# EAGLE design TiNRS - RoundedCornerThing (EAGLE 7.7.0)

## Sheet 1 of 4: Power & Modulation Routing
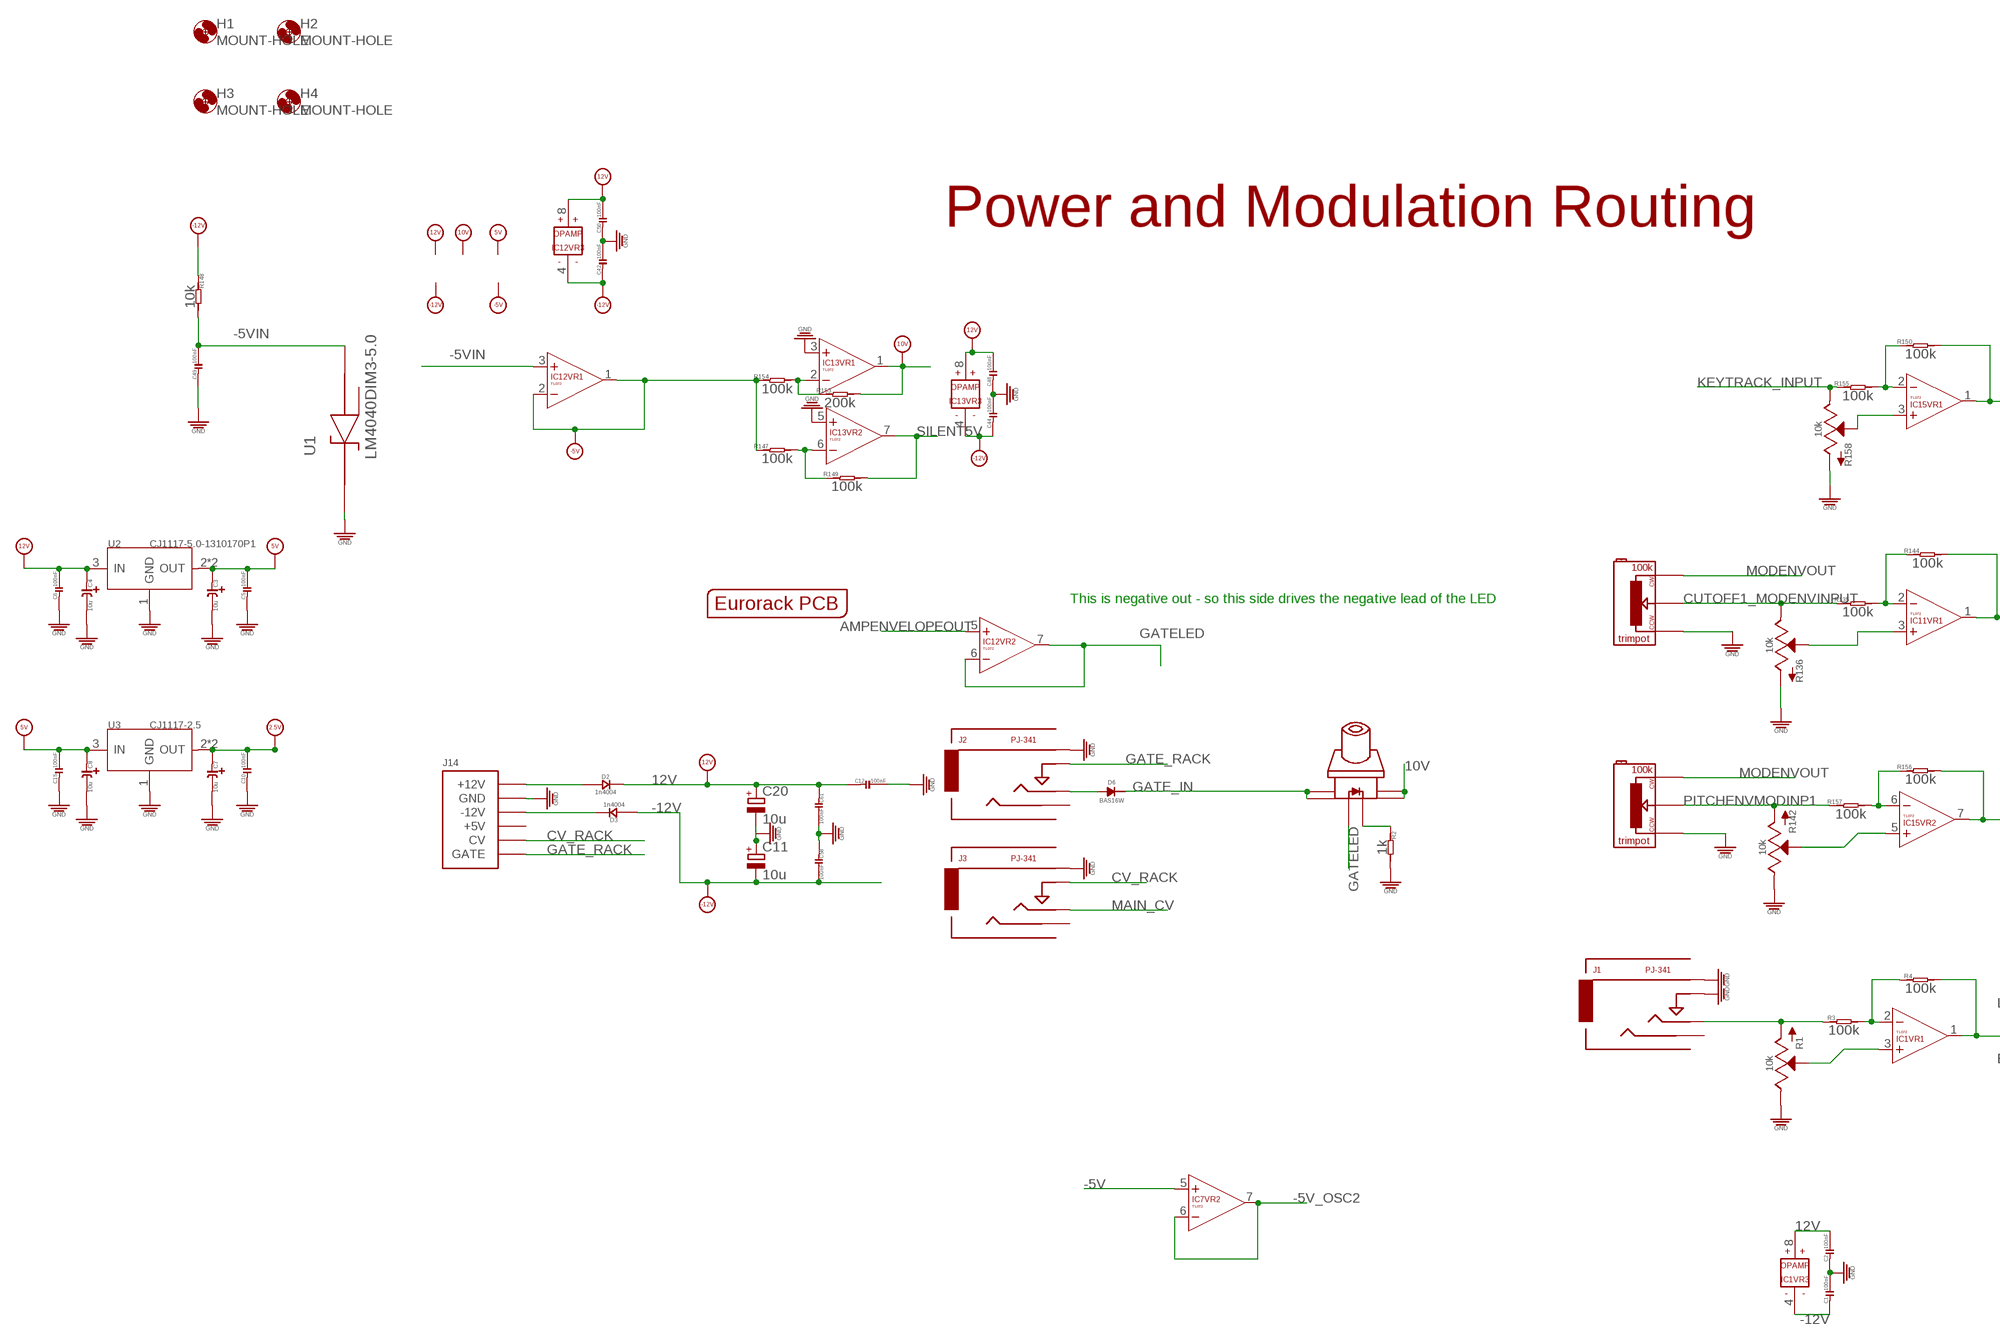
[diagram p0: schematic, sheet 1, part 1 of 2]
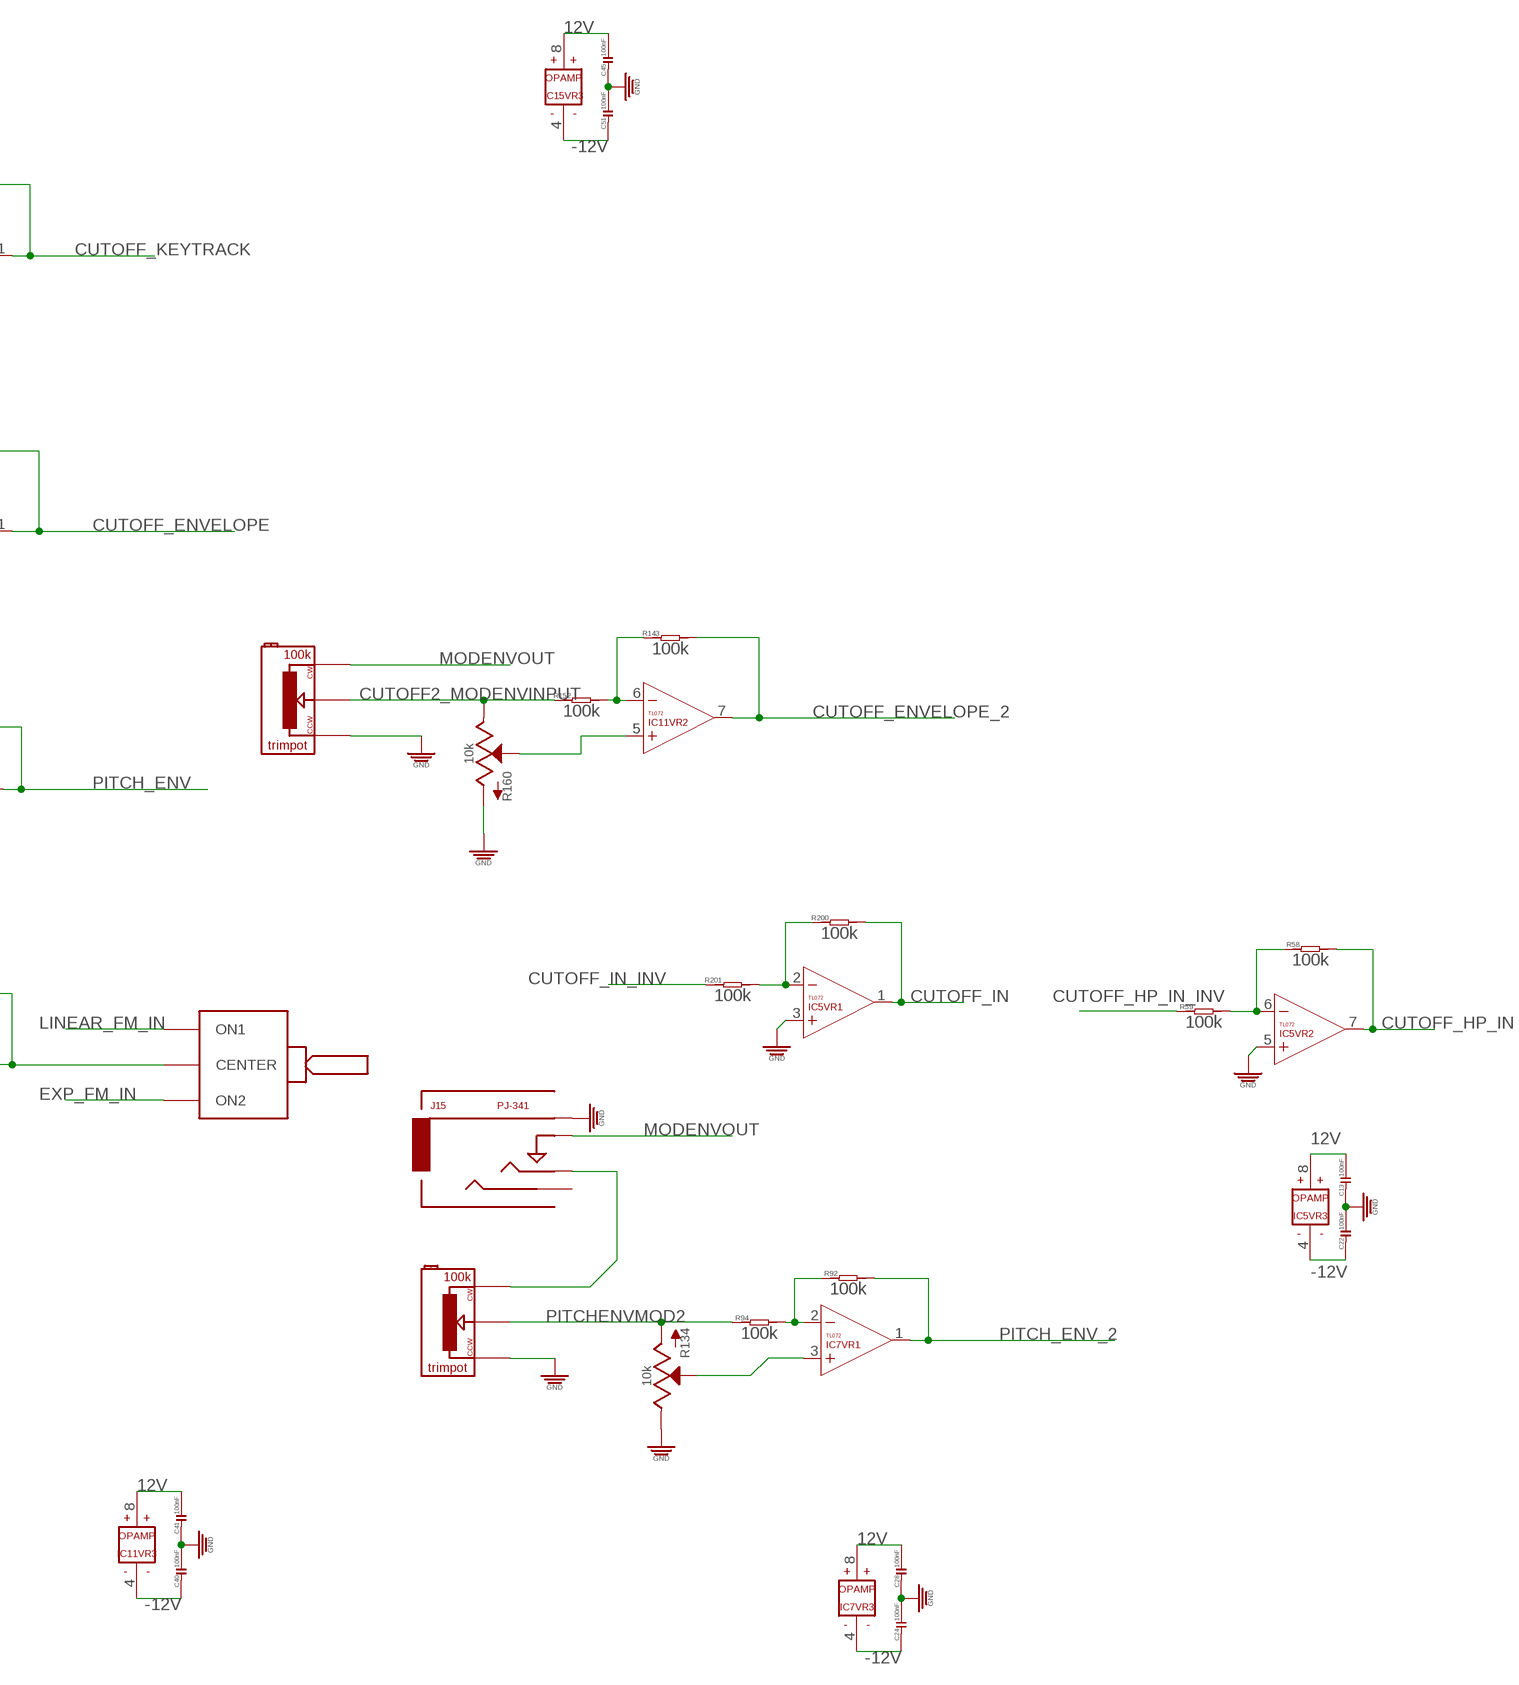
[diagram p1: schematic, sheet 1, part 2 of 2]

### Parts
C1  100nF  C-0603  [C0603]
C2  100nF  C-0603  [C0603]
C3  10u  C-POLAR-A  [CASE-A_3216]
C4  10u  C-POLAR-A  [CASE-A_3216]
C5  100nF  C-0603  [C0603]
C6  100nF  C-0603  [C0603]
C7  10u  C-POLAR-A  [CASE-A_3216]
C8  10u  C-POLAR-A  [CASE-A_3216]
C10  100nF  C-0603  [C0603]
C11  10u  CAPACITOR_POL-CASE_B  [CASE_B]
C12  100nF  C-0603  [C0603]
C13  100nF  C-0603  [C0603]
C15  100nF  C-0603  [C0603]
C20  10u  CAPACITOR_POL-CASE_B  [CASE_B]
C22  100nF  C-0603  [C0603]
C24  100nF  C-0603  [C0603]
C28  100nF  C-0603  [C0603]
C40  100nF  C-0603  [C0603]
C41  100nF  C-0603  [C0603]
C42  100nF  C-0603  [C0603]
C44  100nF  C-0603  [C0603]
C45  100nF  C-0603  [C0603]
C48  100nF  C-0603  [C0603]
C49  100nF  C-0603  [C0603]
C50  100nF  C-0603  [C0603]
C51  100nF  C-0603  [C0603]
C58  100nF  C-0603  [C0603]
C61  100nF  C-0603  [C0603]
D2  1n4004  D-SMA  [DO-214AC]
D3  1n4004  D-SMA  [DO-214AC]
D6  BAS16W  [SOT-323]
H1  MOUNT-HOLE  [3.2-NOMARKINGS-SMALLSAFEZONE]
H2  MOUNT-HOLE  [3.2-NOMARKINGS-SMALLSAFEZONE]
H3  MOUNT-HOLE  [3.2-NOMARKINGS-SMALLSAFEZONE]
H4  MOUNT-HOLE  [3.2-NOMARKINGS-SMALLSAFEZONE]
IC1  TL072  [SO08]
IC5  TL072  [SO08]
IC7  TL072  [SO08]
IC11  TL072  [SO08]
IC12  TL072  [SO08]
IC13  TL072  [SO08]
IC15  TL072  [SO08]
J1  PJ-341  AUDIO-JACKNODRILL  [3.5MM-JACK-SWITCH-13MM-NOHOLES]
J2  PJ-341  AUDIO-JACKNODRILL  [3.5MM-JACK-SWITCH-13MM-NOHOLES]
J3  PJ-341  AUDIO-JACKNODRILL  [3.5MM-JACK-SWITCH-13MM-NOHOLES]
J14  POWERSHROUDED  [POWER_16_SHROUDED]
J15  PJ-341  AUDIO-JACKNODRILL  [3.5MM-JACK-SWITCH-13MM-NOHOLES]
PCB1  EURORACK_PCB36HP_10CM  [EURORACK36HP]
R1  10k  POTSQUAREHOLE_SMALLKNOB  [ALPS_POT_SQUAREHOLES]
R2  1k  R-0603  [R0603]
R3  100k  R-0603  [R0603]
R4  100k  R-0603  [R0603]
R58  100k  R-0603  [R0603]
R59  100k  R-0603  [R0603]
R92  100k  R-0603  [R0603]
R94  100k  R-0603  [R0603]
R134  10k  POTSQUAREHOLE_SMALLKNOB  [ALPS_POT_SQUAREHOLES]
R135  100k  R-0603  [R0603]
R136  10k  POTSQUAREHOLE_SMALLKNOB  [ALPS_POT_SQUAREHOLES]
R142  10k  POTSQUAREHOLE_SMALLKNOB  [ALPS_POT_SQUAREHOLES]
R143  100k  R-0603  [R0603]
R144  100k  R-0603  [R0603]
R147  100k  R-0603  [R0603]
R148  10k  R-0603  [R0603]
R149  100k  R-0603  [R0603]
R150  100k  R-0603  [R0603]
R152  100k  R-0603  [R0603]
R153  200k  R-0603  [R0603]
R154  100k  R-0603  [R0603]
R155  100k  R-0603  [R0603]
R156  100k  R-0603  [R0603]
R157  100k  R-0603  [R0603]
R158  10k  POTSQUAREHOLE_SMALLKNOB  [ALPS_POT_SQUAREHOLES]
R160  10k  POTSQUAREHOLE_SMALLKNOB  [ALPS_POT_SQUAREHOLES]
R191  100k  TRIMPOT  [TRIMPOT]
R192  100k  TRIMPOT  [TRIMPOT]
R193  100k  TRIMPOT  [TRIMPOT]
R194  100k  TRIMPOT  [TRIMPOT]
R200  100k  R-0603  [R0603]
R201  100k  R-0603  [R0603]
S1  ONOFFONNOHOLES  [MULTICOMP1MS-ONOFFON_NOHOLES]
S2  SWITCH_W_LED_PB6149L-X-102YELLOW  [PB6149L]
U1  LM4040DIM3-5.0  [SOT95P237X112-3N]
U2  CJ1117-5.0-1310170P1  [SOT223]
U3  CJ1117-2.5  CJ1117-5.0-1310170P1  [SOT223]

### Nets
2.5V [power]: C7.+ C10.2 U3.2(OUT) U3.TER(OUT) ; also sheet 2
5V [power]: C3.+ C5.2 C8.+ C15.2 U2.2(OUT) U2.TER(OUT) U3.3(IN) ; also sheet 2,3,4
10V [power]: IC13.1(VR1:OUT) R153.2 S2.3 S2.4 ; also sheet 4
12V [power]: C2.2 C4.+ C6.2 C12.1 C13.2 C20.+ C28.2 C41.2 C45.2 C48.2 C50.2 C61.1 D2.2(-) IC1.8(VR3:V+) IC5.8(VR3:V+) IC7.8(VR3:V+) IC11.8(VR3:V+) IC12.8(VR3:V+) IC13.8(VR3:V+) IC15.8(VR3:V+) U2.3(IN) ; also sheet 2,3
-5_TO_10V: IC13.2(VR1:-IN) R153.1 R154.2
-5V [power]: IC7.5(VR2:+IN) IC12.1(VR1:OUT) IC12.2(VR1:-IN) R147.1 R154.1 ; also sheet 2,3
-5V_OSC2: IC7.6(VR2:-IN) IC7.7(VR2:OUT)
-5V_TO_5V: IC13.6(VR2:-IN) R147.2 R149.1
-5VIN [power]: C49.2 IC12.3(VR1:+IN) R148.2 U1.2(ANODE)
-12V [power]: C1.1 C11.- C22.1 C24.1 C40.1 C42.1 C44.1 C51.1 C58.2 D3.1(+) IC1.4(VR3:V-) IC5.4(VR3:V-) IC7.4(VR3:V-) IC11.4(VR3:V-) IC12.4(VR3:V-) IC13.4(VR3:V-) IC15.4(VR3:V-) R148.1 ; also sheet 2,3
AMPENVELOPEOUT: IC12.5(VR2:+IN) ; also sheet 3
CUTOFF1_MODENVINPUT: R135.1 R136.P$1(E) R192.P$2
CUTOFF2_MODENVINPUT: R152.1 R160.P$1(E) R194.P$2
CUTOFF_ENVELOPE: IC11.1(VR1:OUT) R144.2
CUTOFF_ENVELOPE_2: IC11.7(VR2:OUT) R143.2
CUTOFF_HP_IN: IC5.7(VR2:OUT) R58.2
CUTOFF_HP_IN_INV: R59.1 ; also sheet 4
CUTOFF_IN: IC5.1(VR1:OUT) R200.2
CUTOFF_IN_INV: R201.1 ; also sheet 4
CUTOFF_KEYTRACK: IC15.1(VR1:OUT) R150.2
CV_RACK: J3.SWITCH_B@1(SWITCH) J3.SWITCH_T@3(SWITCH) J14.13(CV) J14.14(CV)
EXP_FM_IN: S1.3_B(ON2) S1.3_T(ON2) ; also sheet 2
GATE_IN: D6.CATHODE S2.1 S2.2 ; also sheet 3
GATE_RACK: J2.SWITCH_B@1(SWITCH) J2.SWITCH_T@3(SWITCH) J14.15(GATE) J14.16(GATE)
GATELED: IC12.6(VR2:-IN) IC12.7(VR2:OUT) S2.LEDPOS(POS)
GND [power]: C1.2 C2.1 C3.- C4.- C5.1 C6.1 C7.- C8.- C10.1 C11.+ C12.2 C13.1 C15.1 C20.- C22.2 C24.2 C28.1 C40.2 C41.1 C42.2 C44.2 C45.1 C48.1 C49.1 C50.1 C51.2 C58.1 C61.2 IC5.3(VR1:+IN) IC5.5(VR2:+IN) IC13.3(VR1:+IN) IC13.5(VR2:+IN) J1.RING_B@1(RING) J1.RING_T@3(RING) J1.SWITCH_B@1(SWITCH) J1.SWITCH_T@3(SWITCH) J2.RING_B@1(RING) J2.RING_T@3(RING) J3.RING_B@1(RING) J3.RING_T@3(RING) J14.3(GND) J14.4(GND) J14.5(GND) J14.6(GND) J14.7(GND) J14.8(GND) J15.RING_B@1(RING) J15.RING_T@3(RING) R1.P$1(E) R2.2 R134.P$1(E) R136.P$3(A) R142.P$1(E) R158.P$3(A) R160.P$3(A) R191.P$1 R192.P$1 R193.P$1 R194.P$1 U1.1(CATHODE) U2.1(GND) U3.1(GND) ; also sheet 2,3,4
KEYTRACK_INPUT: R155.1 R158.P$1(E) ; also sheet 2
LINEAR_FM_IN: S1.1_B(ON1) S1.1_T(ON1)
MAIN_CV: J3.TIP_B@1(TIP) J3.TIP_T@3(TIP) ; also sheet 2
MODENVOUT: J15.SWITCH_B@1(SWITCH) J15.SWITCH_T@3(SWITCH) R192.P$3 R193.P$3 R194.P$3 ; also sheet 3
N$7 [power]: D2.1(+) J14.9(+12V) J14.10(+12V)
N$8 [power]: D3.2(-) J14.1(-12V) J14.2(-12V)
N$22: R2.1 S2.LEDNEG(NEG)
N$39: J15.TIP_B@1(TIP) J15.TIP_T@3(TIP) R191.P$3
N$41: IC1.1(VR1:OUT) R4.2 S1.2_B(CENTER) S1.2_T(CENTER)
N$56: IC5.6(VR2:-IN) R58.1 R59.2
N$66: IC1.2(VR1:-IN) R3.2 R4.1
N$67: IC15.2(VR1:-IN) R150.1 R155.2
N$68: IC15.3(VR1:+IN) R158.P$2(S)
N$69: IC11.2(VR1:-IN) R135.2 R144.1
N$72: IC15.6(VR2:-IN) R156.1 R157.2
N$73: IC11.3(VR1:+IN) R136.P$2(S)
N$75: IC7.2(VR1:-IN) R92.1 R94.2
N$76: IC7.3(VR1:+IN) R134.P$2(S)
N$78: IC15.5(VR2:+IN) R142.P$2(S)
N$81: IC1.3(VR1:+IN) R1.P$2(S)
N$82: J1.TIP_B@1(TIP) J1.TIP_T@3(TIP) R1.P$3(A) R3.1
N$86: D6.ANODE J2.TIP_B@1(TIP) J2.TIP_T@3(TIP)
N$126: IC11.6(VR2:-IN) R143.1 R152.2
N$127: IC11.5(VR2:+IN) R160.P$2(S)
N$148: IC5.2(VR1:-IN) R200.1 R201.2
PITCH_ENV: IC15.7(VR2:OUT) R156.2
PITCH_ENV_2: IC7.1(VR1:OUT) R92.2
PITCHENVMOD2: R94.1 R134.P$3(A) R191.P$2
PITCHENVMODINP1: R142.P$3(A) R157.1 R193.P$2
SILENT5V [power]: IC13.7(VR2:OUT) R149.2
Unconnected: IC1.5(VR2:+IN) IC1.6(VR2:-IN) IC1.7(VR2:OUT) J1.SECOND_B@1(SECOND) J1.SECOND_T@3(SECOND) J2.SECOND_B@1(SECOND) J2.SECOND_T@3(SECOND) J3.SECOND_B@1(SECOND) J3.SECOND_T@3(SECOND) J14.11(+5V) J14.12(+5V) J15.SECOND_B@1(SECOND) J15.SECOND_T@3(SECOND) U1.3(NC)

### Notes on the sheet
- Power and Modulation Routing
- This is negative out - so this side drives the negative lead of the LED

## Sheet 2 of 4: Oscillator
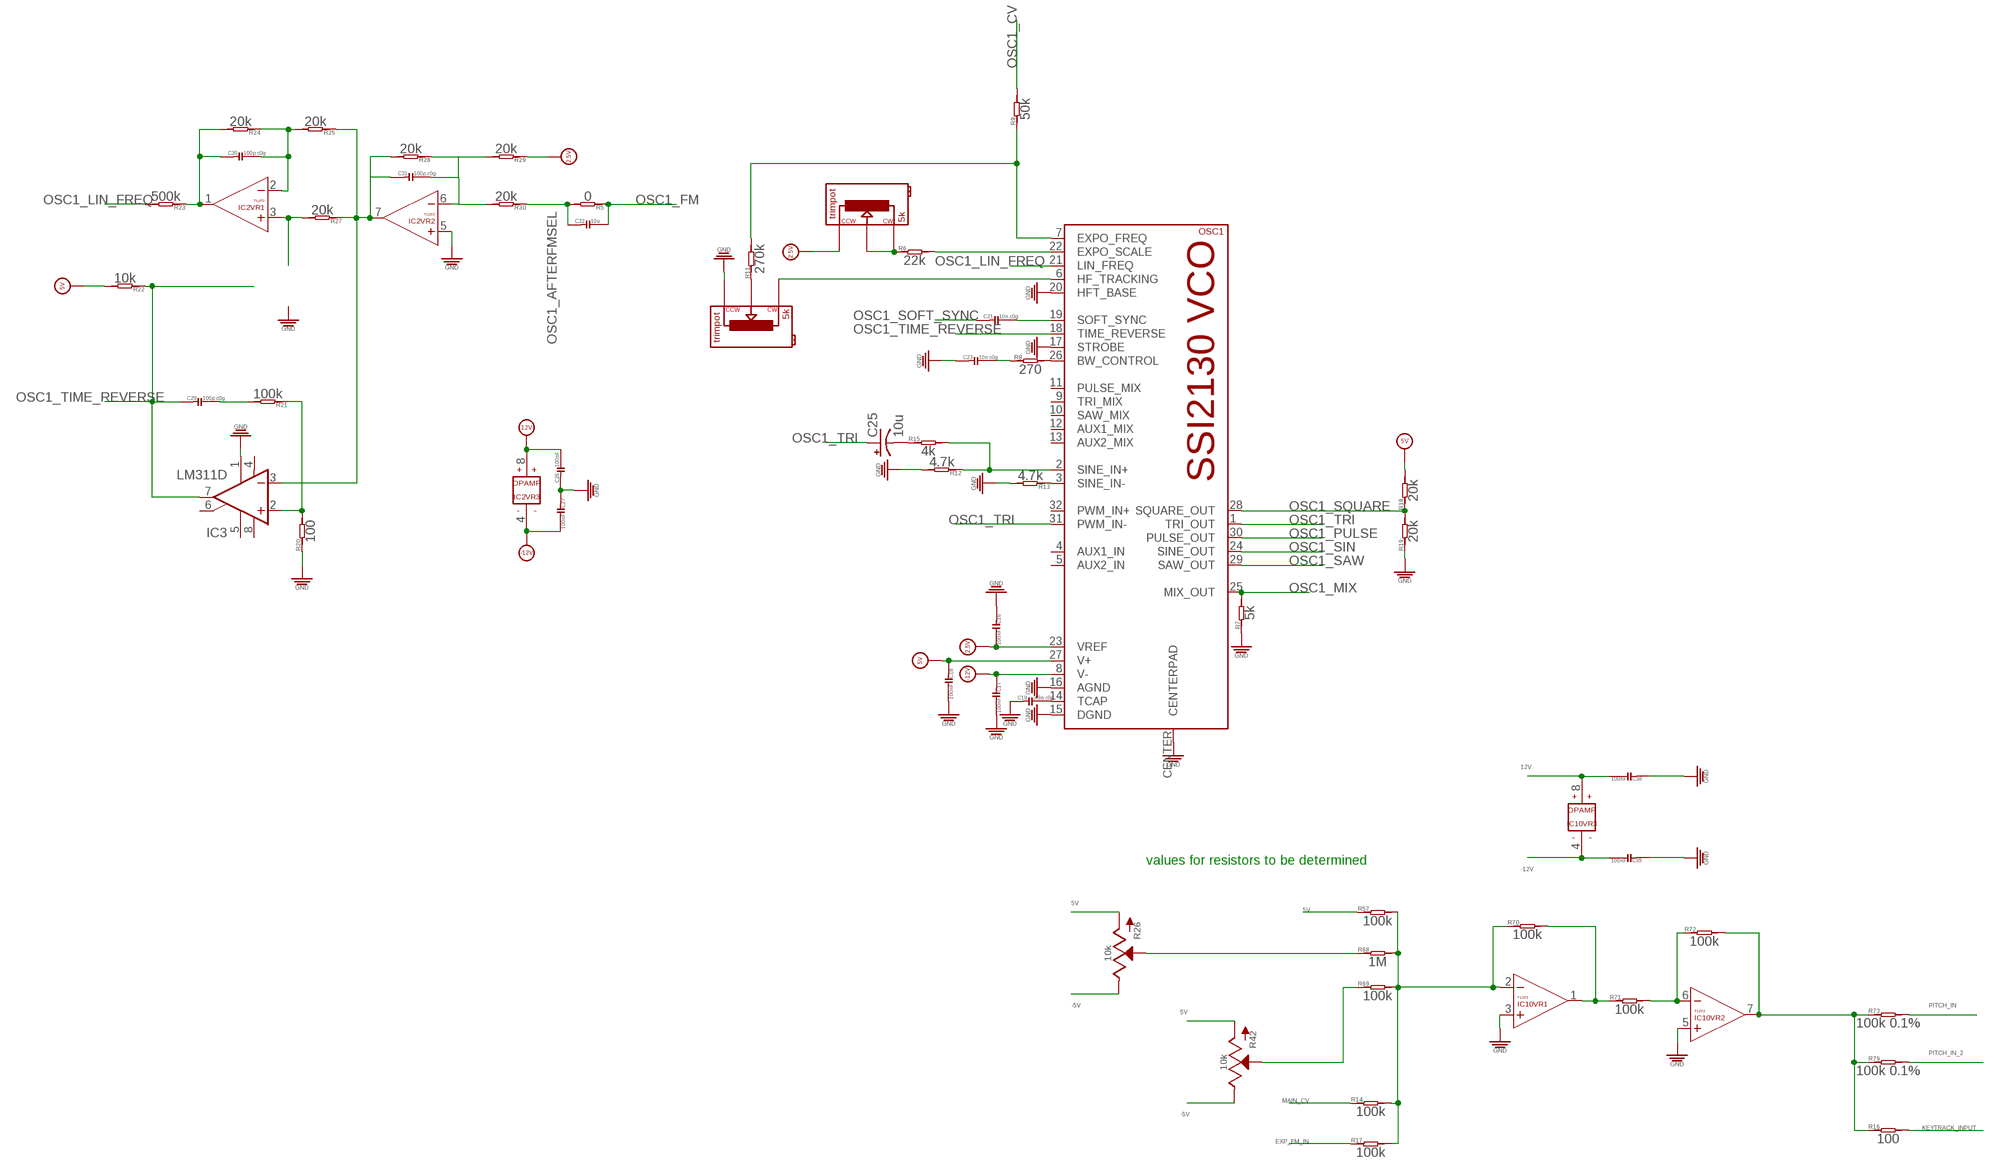
[diagram p2: schematic, sheet 2]

### Parts
C16  100nF  C-0603  [C0603]
C17  100nF  C-0603  [C0603]
C18  100nF  C-0603  [C0603]
C19  3.9n c0g  C-0603  [C0603]
C21  10n c0g  C-0603  [C0603]
C23  10n c0g  C-0603  [C0603]
C25  10u  CPOL-US153CLV-0605  [153CLV-0605]
C26  100nF  C-0603  [C0603]
C27  100nF  C-0603  [C0603]
C29  100p c0g  C-0603  [C0603]
C30  100p c0g  C-0603  [C0603]
C31  100p c0g  C-0603  [C0603]
C32  10u  C-0603  [C0603]
C38  100nF  C-0603  [C0603]
C39  100nF  C-0603  [C0603]
IC2  TL072  [SO08]
IC3  LM311D  [SO08]
IC10  TL072  [SO08]
OSC1  SSI2130  [QFN32_4X4]
R5  0  R-0603  [R0603]
R6  22k  R-0603  [R0603]
R7  5k  R-0603  [R0603]
R8  270  R-0603  [R0603]
R9  50k  R-0603  [R0603]
R10  5k  TRIMPOT  [TRIMPOT]
R11  270k  R-0603  [R0603]
R12  4.7k  R-0603  [R0603]
R13  4.7k  R-0603  [R0603]
R14  100k  R-0603  [R0603]
R15  4k  R-0603  [R0603]
R16  100  R-0603  [R0603]
R17  100k  R-0603  [R0603]
R18  20k  R-0603  [R0603]
R19  20k  R-0603  [R0603]
R20  100  R-0603  [R0603]
R21  100k  R-0603  [R0603]
R22  10k  R-0603  [R0603]
R23  500k  R-0603  [R0603]
R24  20k  R-0603  [R0603]
R25  20k  R-0603  [R0603]
R26  10k  POTSQUAREHOLE_SMALLKNOB  [ALPS_POT_SQUAREHOLES]
R27  20k  R-0603  [R0603]
R28  20k  R-0603  [R0603]
R29  20k  R-0603  [R0603]
R30  20k  R-0603  [R0603]
R42  10k  POTSQUAREHOLE_SMALLKNOB  [ALPS_POT_SQUAREHOLES]
R57  100k  R-0603  [R0603]
R68  1M  R-0603  [R0603]
R69  100k  R-0603  [R0603]
R70  100k  R-0603  [R0603]
R71  100k  R-0603  [R0603]
R72  100k  R-0603  [R0603]
R73  100k 0.1%  R-0603  [R0603]
R79  100k 0.1%  R-0603  [R0603]
R189  5k  TRIMPOT  [TRIMPOT]

### Nets
2.5V [power]: C16.2 OSC1.23(VREF) R29.1 R189.P$1 ; also sheet 1
5V [power]: C18.1 OSC1.27(V+) R18.2 R22.2 R26.P$3(A) R42.P$3(A) R57.1 ; also sheet 1,3,4
12V [power]: C26.2 C38.2 IC2.8(VR3:V+) IC10.8(VR3:V+) ; also sheet 1,3
-5V [power]: R26.P$1(E) R42.P$1(E) ; also sheet 1,3
-12V [power]: C17.1 C27.2 C39.2 IC2.4(VR3:V-) IC10.4(VR3:V-) OSC1.8(V-) ; also sheet 1,3
EXP_FM_IN: R17.1 ; also sheet 1
GND [power]: C16.1 C17.2 C18.2 C19.1 C23.1 C26.1 C27.1 C38.1 C39.1 IC2.5(VR2:+IN) IC3.1(GND) IC10.3(VR1:+IN) IC10.5(VR2:+IN) OSC1.15(DGND) OSC1.16(AGND) OSC1.17(STROBE) OSC1.20(HFT_BASE) OSC1.CENTER(CENTERPAD) R7.1 R10.P$1 R12.2 R13.2 R19.1 R20.1 ; also sheet 1,3,4
INVERTED_CVSUM: IC10.1(VR1:OUT) R70.2 R71.1
KEYTRACK_INPUT: R16.2 ; also sheet 1
MAIN_CV: R14.1 ; also sheet 1
MAIN_CV_SUMLINE: IC10.2(VR1:-IN) R14.2 R17.2 R57.2 R68.2 R69.2 R70.1
MASTER_COARSEPITCH: R42.P$2(S) R69.1
MASTER_FINEPITCH: R26.P$2(S) R68.1
N$5: C19.2 OSC1.14(TCAP)
N$12: C21.2 OSC1.19(SOFT_SYNC)
N$13: C31.2 IC2.6(VR2:-IN) R30.2
N$14: OSC1.22(EXPO_SCALE) R6.2
N$15: R6.1 R189.P$2 R189.P$3
N$16: C23.2 R8.1
N$17: OSC1.26(BW_CONTROL) R8.2
N$18: OSC1.7(EXPO_FREQ) R9.1 R11.2
N$19: OSC1.6(HF_TRACKING) R10.P$3
N$20: R10.P$2 R11.1
N$21: C25.- R15.1
N$23: C30.1 IC2.1(VR1:OUT) R23.1 R24.2
N$24: OSC1.2(SINE_IN+) R12.1 R15.2
N$25: OSC1.3(SINE_IN-) R13.1
N$26: C30.2 IC2.2(VR1:-IN) R24.1 R25.2
N$27: C31.1 IC2.7(VR2:OUT) IC3.3(-IN) R25.1 R27.1 R28.2
N$28: IC2.3(VR1:+IN) R27.2
N$29: R28.1 R29.2
N$30: IC3.2(+IN) R20.2 R21.1
N$31: C29.2 R21.2
OSC1_AFTERFMSEL: C32.1 R5.2 R30.1
OSC1_CV: R9.2
OSC1_FM: C32.2 R5.1
OSC1_LIN_FREQ: OSC1.21(LIN_FREQ) R23.2
OSC1_MIX: OSC1.25(MIX_OUT) R7.2
OSC1_PULSE: OSC1.30(PULSE_OUT)
OSC1_SAW: OSC1.29(SAW_OUT)
OSC1_SIN: OSC1.24(SINE_OUT)
OSC1_SOFT_SYNC: C21.1
OSC1_SQUARE: OSC1.28(SQUARE_OUT) R18.1 R19.2
OSC1_TIME_REVERSE [power]: C29.1 IC3.7(OUT) OSC1.18(TIME_REVERSE) R22.1
OSC1_TRI: C25.+ OSC1.1(TRI_OUT) OSC1.31(PWM_IN-)
PITCH_IN: R73.2
PITCH_IN_2: R79.2
POSTINVERTED_CVSUM: IC10.6(VR2:-IN) R71.2 R72.1
PRESUMMED_PITCH: IC10.7(VR2:OUT) R16.1 R72.2 R73.1 R79.1
Unconnected: IC3.5(ON) IC3.6(ON/STR) OSC1.4(AUX1_IN) OSC1.5(AUX2_IN) OSC1.9(TRI_MIX) OSC1.10(SAW_MIX) OSC1.11(PULSE_MIX) OSC1.12(AUX1_MIX) OSC1.13(AUX2_MIX) OSC1.32(PWM_IN+)

### Notes on the sheet
- values for resistors to be determined

## Sheet 3 of 4: Envelopes
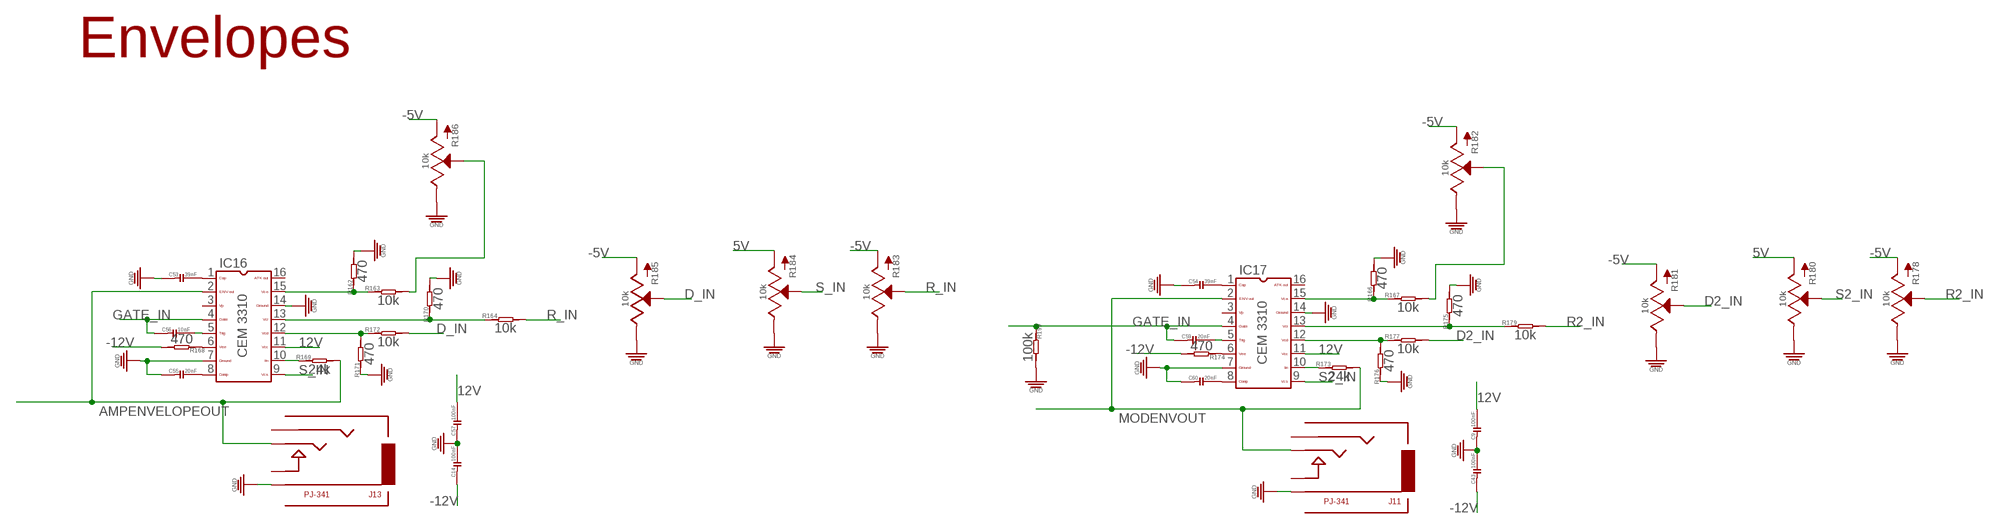
[diagram p3: schematic, sheet 3]

### Parts
C9  100nF  C-0603  [C0603]
C14  100nF  C-0603  [C0603]
C43  100nF  C-0603  [C0603]
C53  39nF  C-0603  [C0603]
C54  39nF  C-0603  [C0603]
C55  20nF  C-0603  [C0603]
C56  10nF  C-0603  [C0603]
C57  100nF  C-0603  [C0603]
C59  20nF  C-0603  [C0603]
C60  20nF  C-0603  [C0603]
IC16  CEM3310SOIC16  [SO16]
IC17  CEM3310SOIC16  [SO16]
J11  PJ-341  AUDIO-JACKNODRILL  [3.5MM-JACK-SWITCH-13MM-NOHOLES]
J13  PJ-341  AUDIO-JACKNODRILL  [3.5MM-JACK-SWITCH-13MM-NOHOLES]
R162  470  R-0603  [R0603]
R163  10k  R-0603  [R0603]
R164  10k  R-0603  [R0603]
R166  470  R-0603  [R0603]
R167  10k  R-0603  [R0603]
R168  470  R-0603  [R0603]
R169  24k  R-0603  [R0603]
R170  470  R-0603  [R0603]
R171  470  R-0603  [R0603]
R172  10k  R-0603  [R0603]
R173  24k  R-0603  [R0603]
R174  470  R-0603  [R0603]
R175  470  R-0603  [R0603]
R176  470  R-0603  [R0603]
R177  10k  R-0603  [R0603]
R178  10k  POTSQUAREHOLE_SMALLKNOB  [ALPS_POT_SQUAREHOLES]
R179  10k  R-0603  [R0603]
R180  10k  POTSQUAREHOLE_SMALLKNOB  [ALPS_POT_SQUAREHOLES]
R181  10k  POTSQUAREHOLE_SMALLKNOB  [ALPS_POT_SQUAREHOLES]
R182  10k  POTSQUAREHOLE_SMALLKNOB  [ALPS_POT_SQUAREHOLES]
R183  10k  POTSQUAREHOLE_SMALLKNOB  [ALPS_POT_SQUAREHOLES]
R184  10k  POTSQUAREHOLE_SMALLKNOB  [ALPS_POT_SQUAREHOLES]
R185  10k  POTSQUAREHOLE_SMALLKNOB  [ALPS_POT_SQUAREHOLES]
R186  10k  POTSQUAREHOLE_SMALLKNOB  [ALPS_POT_SQUAREHOLES]
R199  100k  R-0603  [R0603]

### Nets
5V [power]: R180.P$3(A) R184.P$3(A) ; also sheet 1,2,4
12V [power]: C9.2 C57.2 IC16.11 IC17.11 ; also sheet 1,2
-5V [power]: R178.P$3(A) R181.P$3(A) R182.P$3(A) R183.P$3(A) R185.P$3(A) R186.P$3(A) ; also sheet 1,2
-12V [power]: C14.1 C43.1 R168.2 R174.2 ; also sheet 1,2
A2_IN: R167.2 R182.P$2(S)
A_IN: R163.2 R186.P$2(S)
AMPENVELOPEOUT: IC16.2 J13.TIP_B@1(TIP) J13.TIP_T@3(TIP) R169.2 ; also sheet 1
D2_IN: R177.2 R181.P$2(S)
D_IN: R172.2 R185.P$2(S)
GATE_IN: C56.1 C59.1 IC16.4 IC17.4 R199.1 ; also sheet 1
GND [power]: C9.1 C14.2 C43.2 C53.1 C54.1 C55.1 C57.1 C60.1 IC16.7 IC16.14 IC17.7 IC17.14 J11.RING_B@1(RING) J11.RING_T@3(RING) J13.RING_B@1(RING) J13.RING_T@3(RING) R162.2 R166.2 R170.2 R171.1 R175.2 R176.1 R178.P$1(E) R180.P$1(E) R181.P$1(E) R182.P$1(E) R183.P$1(E) R184.P$1(E) R185.P$1(E) R186.P$1(E) R199.2 ; also sheet 1,2,4
MODENVOUT: IC17.2 J11.TIP_B@1(TIP) J11.TIP_T@3(TIP) R173.2 ; also sheet 1
N$1: IC16.15 R162.1 R163.1
N$2: IC16.12 R171.2 R172.1
N$3: IC16.13 R164.1 R170.1
N$4: C53.2 IC16.1
N$6: C56.2 IC16.5
N$9: IC16.6 R168.1
N$10: C55.2 IC16.8
N$11: IC16.10 R169.1
N$58: IC17.15 R166.1 R167.1
N$59: IC17.12 R176.2 R177.1
N$60: IC17.13 R175.1 R179.1
N$61: C59.2 IC17.5
N$62: IC17.6 R174.1
N$63: C60.2 IC17.8
N$64: IC17.10 R173.1
N$65: C54.2 IC17.1
R2_IN: R178.P$2(S) R179.2
R_IN: R164.2 R183.P$2(S)
S2_IN: IC17.9 R180.P$2(S)
S_IN: IC16.9 R184.P$2(S)
Unconnected: IC16.3 IC16.16 IC17.3 IC17.16 J11.SECOND_B@1(SECOND) J11.SECOND_T@3(SECOND) J11.SWITCH_B@1(SWITCH) J11.SWITCH_T@3(SWITCH) J13.SECOND_B@1(SECOND) J13.SECOND_T@3(SECOND) J13.SWITCH_B@1(SWITCH) J13.SWITCH_T@3(SWITCH)

### Notes on the sheet
- Envelopes

## Sheet 4 of 4: Filter
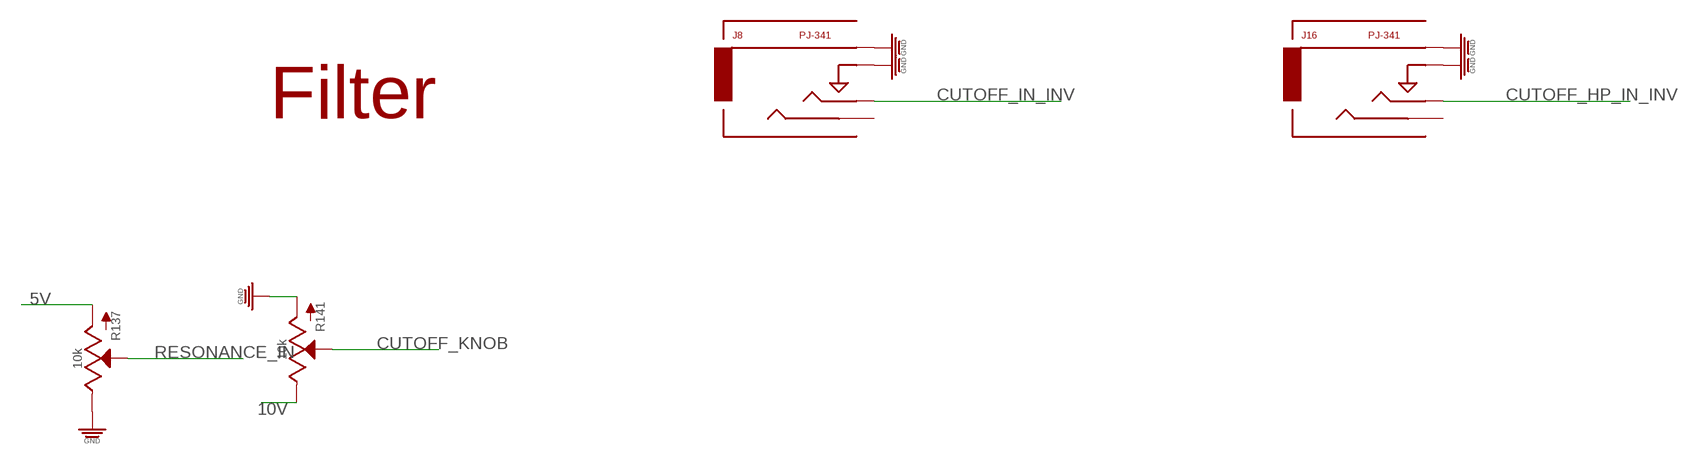
[diagram p4: schematic, sheet 4]

### Parts
J8  PJ-341  AUDIO-JACKNODRILL  [3.5MM-JACK-SWITCH-13MM-NOHOLES]
J16  PJ-341  AUDIO-JACKNODRILL  [3.5MM-JACK-SWITCH-13MM-NOHOLES]
R137  10k  POTSQUAREHOLE_SMALLKNOB  [ALPS_POT_SQUAREHOLES]
R141  10k  POTSQUAREHOLE_SMALLKNOB  [ALPS_POT_SQUAREHOLES]

### Nets
5V [power]: R137.P$3(A) ; also sheet 1,2,3
10V [power]: R141.P$1(E) ; also sheet 1
CUTOFF_HP_IN_INV: J16.TIP_B@1(TIP) J16.TIP_T@3(TIP) ; also sheet 1
CUTOFF_IN_INV: J8.TIP_B@1(TIP) J8.TIP_T@3(TIP) ; also sheet 1
CUTOFF_KNOB: R141.P$2(S)
GND [power]: J8.RING_B@1(RING) J8.RING_T@3(RING) J8.SWITCH_B@1(SWITCH) J8.SWITCH_T@3(SWITCH) J16.RING_B@1(RING) J16.RING_T@3(RING) J16.SWITCH_B@1(SWITCH) J16.SWITCH_T@3(SWITCH) R137.P$1(E) R141.P$3(A) ; also sheet 1,2,3
RESONANCE_IN: R137.P$2(S)
Unconnected: J8.SECOND_B@1(SECOND) J8.SECOND_T@3(SECOND) J16.SECOND_B@1(SECOND) J16.SECOND_T@3(SECOND)

### Notes on the sheet
- Filter

## Power pins joined to a net without a drawn wire
V+: IC3.8(V+)
V-: IC3.4(V-)

## Library data of the parts
C1 C2 C9 C12-C14 C16-C19 C21-C24 C26-C32 C38-C45 C48 C50 C51 C53-C61 = OPL:C*
C3 C4 C7 C8 = EurorackModularParts:C-POLAR*
C5 C6 C10 C15 C49 = OPL:C*; MF: AVX; MPN: 06035C104KAT2A; OC_FARNELL: 1301804
C11 C20 = dp_devices:CAPACITOR_POL: Polarized capacitor in various packages
C25 = adafruit:CPOL-US: POLARIZED CAPACITOR, American symbol
D2 D3 = OPL:D*: DIODE
D6 = FenixBase:BAS16W
H1-H4 = zephod-components:MOUNT-HOLE: MOUNTING HOLE with drill center marker
IC1 IC2 IC5 IC7 IC10-IC13 IC15 = EurorackModularParts:TL072
IC3 = linear:LM311: COMPARATOR
IC16 IC17 = CEM:CEM3310: CEM 3310 VCEG
J1-J3 J8 J11 J13 J15 J16 = EurorackModularParts:AUDIO-JACK: Switching Mono 3.5mm Audio Jack from Erthenvar.
J14 = EurorackModularParts:POWER
OSC1 = SoundSemiconductor:SSI2130
PCB1 = EurorackModularParts:EURORACK_PCB
R1 R134 R136 R137 R142 R158 R160 R178 R180-R186 = EurorackModularParts:POT
R2-R9 R11-R25 R27-R30 R57-R59 R68-R73 R79 R92 R94 R135 R143 R144 R147 R149 R150 R152-R157 R162-R164 R166-R177 R179 R199-R201 = OPL:R*
R10 = EurorackModularParts:TRIMPOT; DESC: Osc1: Hi
R26 = EurorackModularParts:POT; DESC: Osc1 Fine
R42 = EurorackModularParts:POT; DESC: Osc1 Coarse
R141 = EurorackModularParts:POT; DESC: Cutoff
R148 = OPL:R*; OC_FARNELL: unknown
R189 = EurorackModularParts:TRIMPOT; DESC: Osc1: Scale
R191 = EurorackModularParts:TRIMPOT; DESC: Osc2 PitchMod
R192 = EurorackModularParts:TRIMPOT; DESC: LP Cutoff Mod
R193 = EurorackModularParts:TRIMPOT; DESC: Osc1 PitchMod
R194 = EurorackModularParts:TRIMPOT; DESC: HP Cutoff Mod
S1 = EurorackModularParts:ONOFFON
S2 = zephod-components:SWITCH_W_LED_PB6149L-X-102
U1 = FarnellThings:LM4040DIM3-5.0: IC, Precision Micropower Shunt Voltage Reference, 5V,SOT-23-3; MF: TEXAS INSTRUMENTS; MPN: LM4040DIM3-5.0; OC_FARNELL: 9778330; OC_NEWARK: 97K3489; PACKAGE: SOT-23-3; SUPPLIER: TEXAS INSTRUMENTS
U2 U3 = OPL:CJ1117-5.0

## Net classes
0 default: width 0.305 mm
1 power: width 0.508 mm
2 nearfilter: width 0.254 mm
3 groundplane: width 0.203 mm, clearance 0.203 mm

## Board
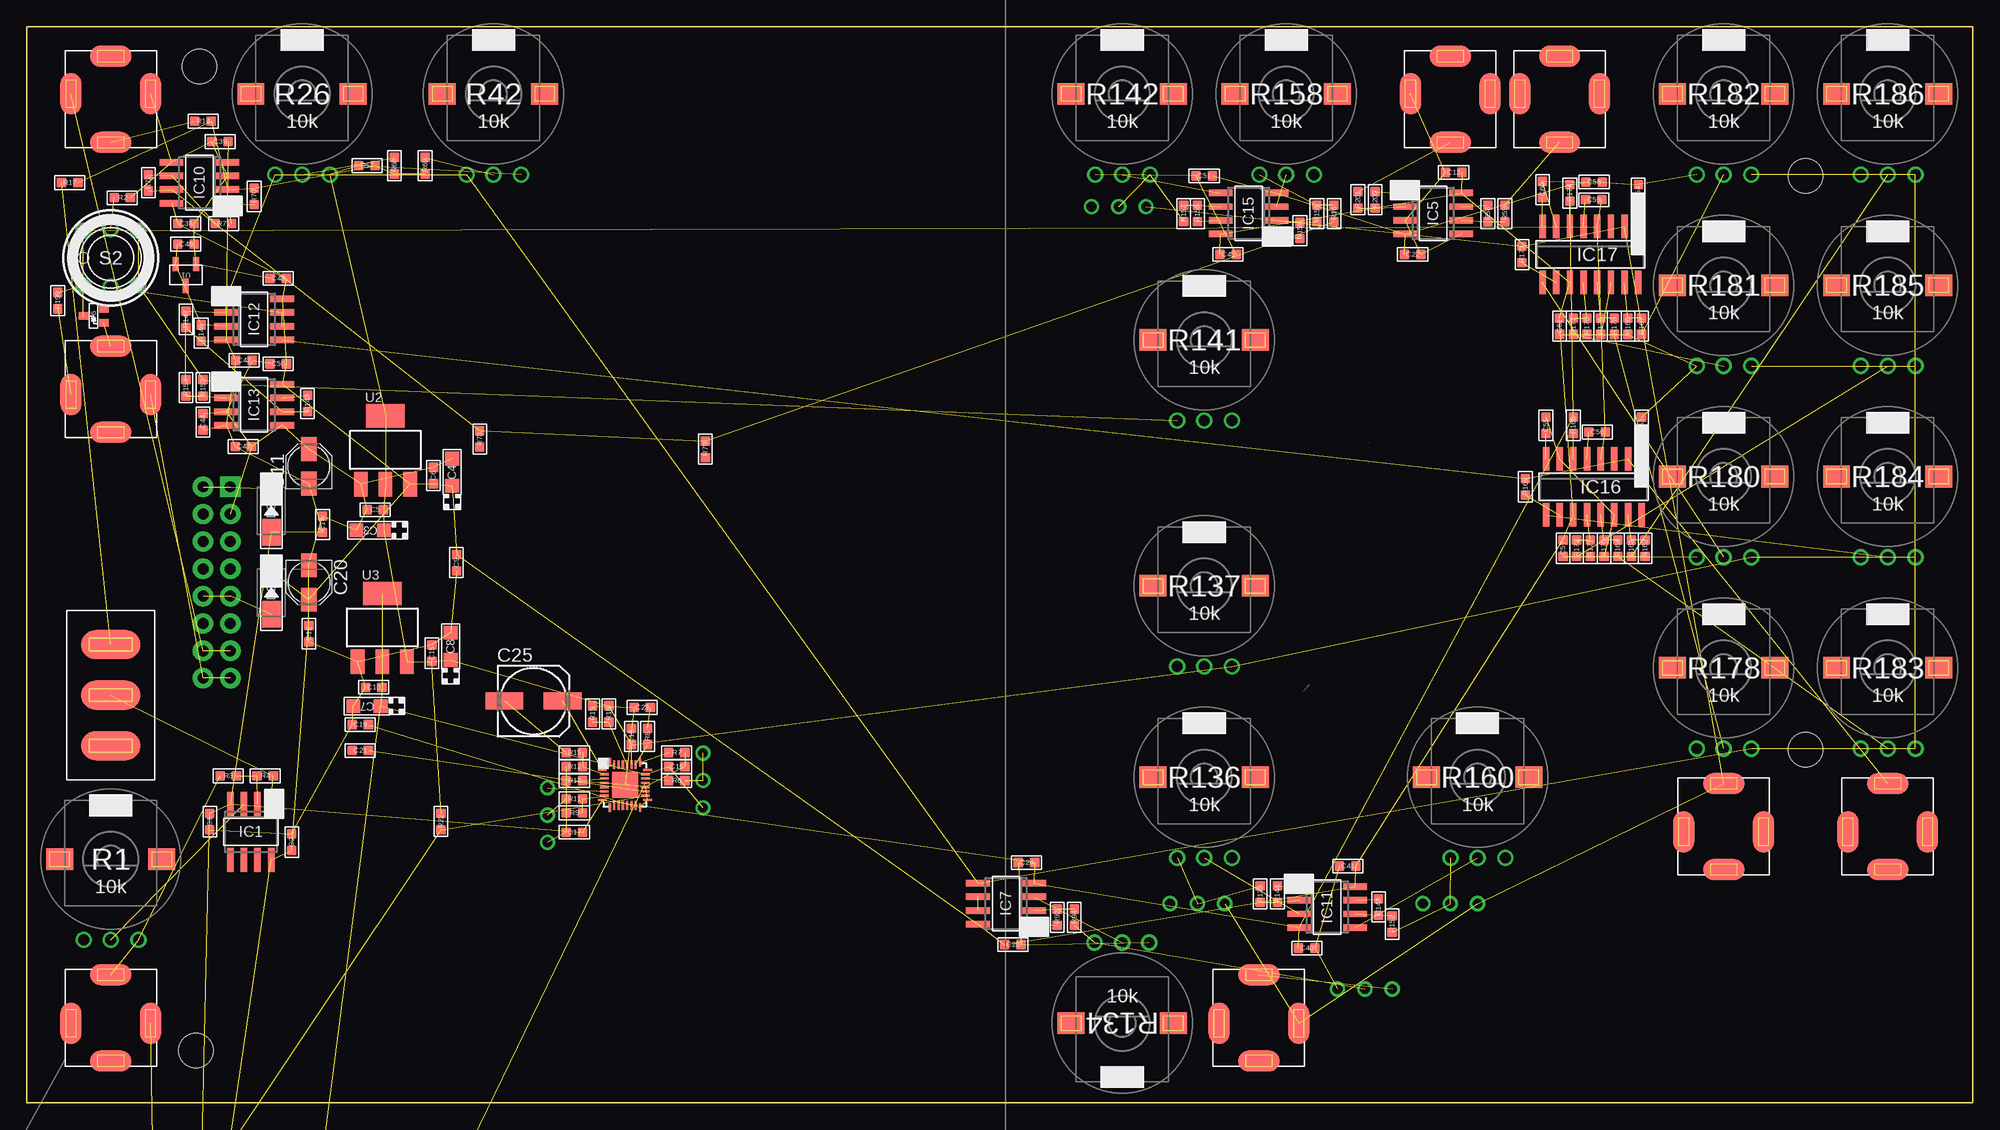
[diagram p5: board, top side]
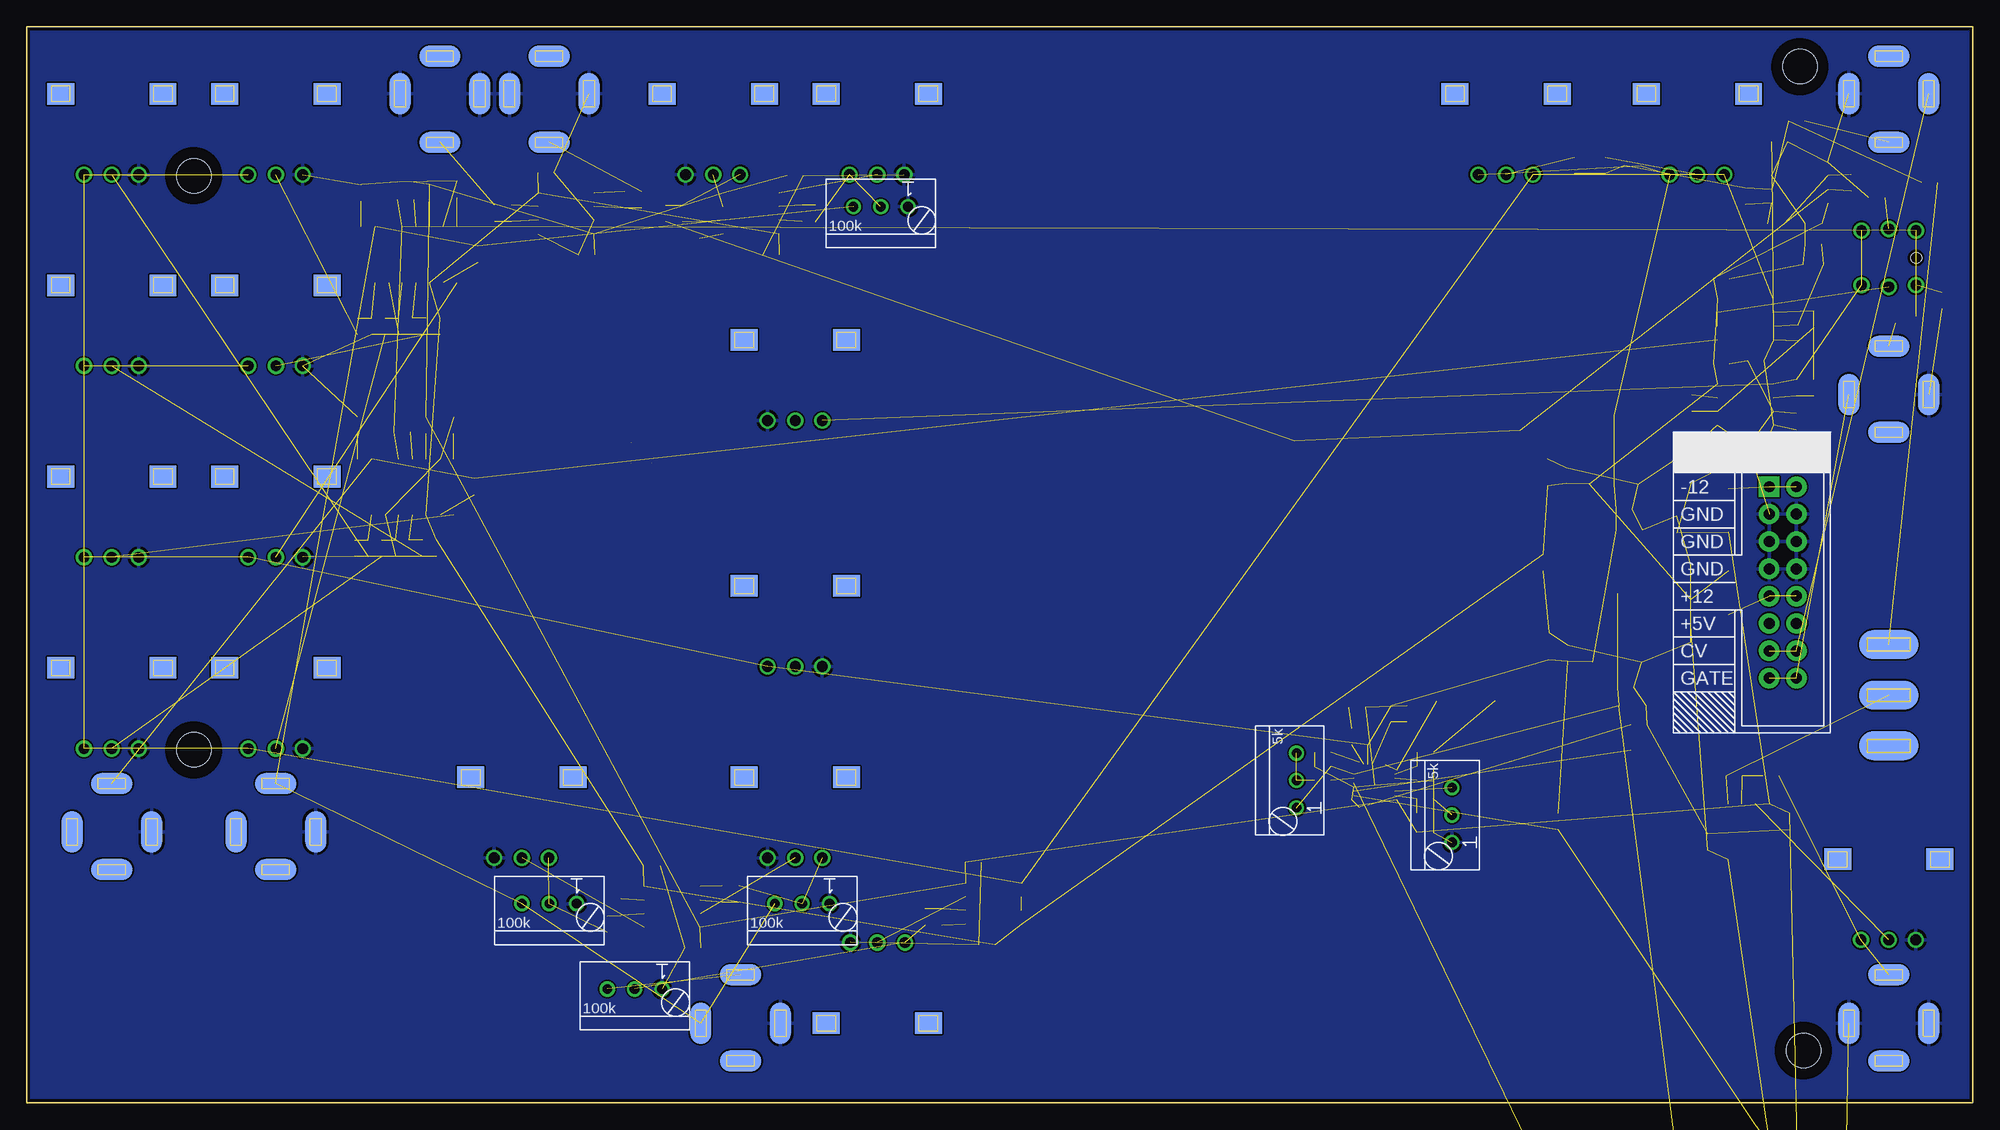
[diagram p6: board, bottom side, seen from below]

Size 180.78 x 100 mm. Coordinates in mm from the lower left corner, seen from the top.
Copper layers (1*16): Top 0.035mm / dielectric 1.5mm / Bottom 0.035mm
Design rules "ITEADstudio_DRC *": minimum track width 6mil, minimum drill 12mil, track to track 6mil, track to pad 6mil, pad to pad 6mil, via to via 6mil, smd to smd 0mil, copper to edge 10mil, drill to drill 10mil, minimum pad ring 10mil, minimum via ring 6mil, stop-mask expansion 2mil, vias tented up to drill 100mil, thermal gap 10mil

### Footprints (pad centres in the part's own frame; a part is rotated, then mirrored left to right if it is on the bottom)
C0603 = smd 0.889 x 0.889: 1 -0.762,0; 2 0.762,0
CASE-A_3216 = smd 1.27 x 1.27: + -1.27,0; - 1.27,0
CASE_B = smd 2.2 x 1.4: + 1.6,0; - -1.6,0
153CLV-0605 = smd 3.5 x 1.6: + 2.7,0; - -2.7,0
DO-214AC = smd 2.5 x 1.7: 1 -2,0; 2 2,0
SOT-323 = smd 0.7 x 0.9: ANODE -0.65,-0.95; CATHODE 0,0.95; NC 0.65,-0.95
3.2-NOMARKINGS-SMALLSAFEZONE = hole 3.2: 0,0
SO08 = smd 0.6 x 2.2: 1 -1.905,-2.6; 2 -0.635,-2.6; 3 0.635,-2.6; 4 1.905,-2.6; 5 1.905,2.6; 6 0.635,2.6; 7 -0.635,2.6; 8 -1.905,2.6
SO16 = smd 0.6 x 2.2: 1 -4.445,-2.6; 2 -3.175,-2.6; 3 -1.905,-2.6; 4 -0.635,-2.6; 5 0.635,-2.6; 6 1.905,-2.6; 7 3.175,-2.6; 8 4.445,-2.6; 9 4.445,2.6; 10 3.175,2.6; 11 1.905,2.6; 12 0.635,2.6; 13 -0.635,2.6; 14 -1.905,2.6; 15 -3.175,2.6; 16 -4.445,2.6
3.5MM-JACK-SWITCH-13MM-NOHOLES = smd 1.95 x 3.85 bottom: RING_B@1 -3.7,0; SWITCH_B@1 3.7,0 | smd 1.95 x 3.85: RING_T@3 -3.7,0; SWITCH_T@3 3.7,0 | smd 3.85 x 1.95 bottom: SECOND_B@1 0,-3.5; TIP_B@1 0,4.5 | smd 3.85 x 1.95: SECOND_T@3 0,-3.5; TIP_T@3 0,4.5
POWER_16_SHROUDED = drill 1.016 pad 1.88 square: 1 -8.89,-1.27 | drill 1.016 pad 1.88: 2 -8.89,1.27; 3 -6.35,-1.27; 4 -6.35,1.27; 5 -3.81,-1.27; 6 -3.81,1.27; 7 -1.27,-1.27; 8 -1.27,1.27; 9 1.27,-1.27; 10 1.27,1.27; 11 3.81,-1.27; 12 3.81,1.27; 13 6.35,-1.27; 14 6.35,1.27; 15 8.89,-1.27; 16 8.89,1.27
QFN32_4X4 = smd 0.8 x 0.2: 1 -2.1,1.4; 2 -1.9,1; 3 -1.9,0.6; 4 -1.9,0.2; 5 -1.9,-0.2; 6 -1.9,-0.6; 7 -1.9,-1; 8 -2.1,-1.4; 17 2.1,-1.4; 18 1.9,-1; 19 1.9,-0.6; 20 1.9,-0.2; 21 1.9,0.2; 22 1.9,0.6; 23 1.9,1; 24 2.1,1.4 | smd 0.2 x 0.8: 9 -1.4,-2.1; 10 -1,-1.9; 11 -0.6,-1.9; 12 -0.2,-1.9; 13 0.2,-1.9; 14 0.6,-1.9; 15 1,-1.9; 16 1.4,-2.1; 25 1.4,2.1; 26 1,1.9; 27 0.6,1.9; 28 0.2,1.9; 29 -0.2,1.9; 30 -0.6,1.9; 31 -1,1.9; 32 -1.4,2.1 | smd 2.4 x 2.4: CENTER 0,0
ALPS_POT_SQUAREHOLES = drill 1: P$1 -2.5,-7.5; P$2 0,-7.5; P$3 2.58,-7.5 | smd 2.5 x 2: P$4 -4.75,0; P$5 4.75,0 | smd 2.5 x 2 bottom: P$6 -4.75,0; P$7 4.75,0
R0603 = smd 0.889 x 0.889: 1 -0.762,0; 2 0.762,0
TRIMPOT = drill 0.9: P$1 -2.54,0; P$2 0,0; P$3 2.54,0
MULTICOMP1MS-ONOFFON_NOHOLES = smd 2.7 x 5.5 bottom: 1_B -4.7,0; 2_B 0,0; 3_B 4.7,0 | smd 2.7 x 5.5: 1_T -4.7,0; 2_T 0,0; 3_T 4.7,0
PB6149L = drill 1: 1 2.54,2.54; 2 2.54,-2.54; 3 -2.54,2.54; 4 -2.54,-2.54; LEDNEG 0,-2.7; LEDPOS 0,2.7 | hole 1: 2.54,0
SOT95P237X112-3N = smd 1.321 x 0.559: 1 -1.016,0.94; 2 -1.016,-0.94; 3 1.016,0
SOT223 = smd 1.27 x 2.286: 1 -2.286,-3.175; 2 0,-3.175; 3 2.286,-3.175 | smd 3.556 x 2.159: TER 0,3.175

### Placement (x,y rotation side)
C1  17,26.15 270 top
C2  24.62,24.24 270 top
C3  31.89,53.23 180 top
C4  39.51,58.62 90 top
C5  32.37,55.13 0 top
C6  37.77,58.31 270 top
C7  31.59,36.88 180 top
C8  39.37,42.43 90 top
C9  39.92,50.21 90 top
C10  32.23,38.62 0 top
C11  26.2,59.17 90 top
C12  26.2,43.61 270 top
C13  132.57,86.47 0 top
C14  27.47,53.77 90 top
C15  37.62,41.8 270 top
C16  60.37,31.25 180 top
C17  50.87,25.15 180 top
C18  56.17,34.05 90 top
C19  30.97,35.15 0 top
C20  26.2,48.37 270 top
C21  30.97,32.75 0 top
C22  128.76,78.85 0 top
C23  57.17,36.75 0 top
C24  92.88,22.34 180 top
C25  47.07,37.35 0 top
C26  7.17,-71.65 90 top  (outside the outline)
C27  14.67,-75.05 270 top  (outside the outline)
C28  91.61,14.72 180 top
C29  -19.53,-62.65 0 top  (outside the outline)
C30  9.27,-80.25 0 top  (outside the outline)
C31  12.07,-67.85 0 top  (outside the outline)
C32  13.67,-63.95 180 top  (outside the outline)
C38  14.77,81.71 180 top
C39  17.95,89.33 0 top
C40  118.91,14.4 0 top
C41  122.72,22.02 0 top
C42  20.17,69.01 0 top
C43  20.11,61.01 0 top
C44  16.36,63.29 90 top
C45  111.61,78.85 180 top
C48  23.35,76.63 0 top
C49  14.77,79.8 180 top
C50  23.35,68.69 0 top
C51  109.39,86.15 180 top
C53  150.03,62.98 270 top
C54  149.71,84.57 270 top
C55  141.14,62.98 270 top
C56  145.9,62.34 180 top
C57  142.73,51.55 90 top
C58  145.61,85.58 180 top
C59  145.58,83.93 180 top
C60  140.82,84.88 270 top
C61  142.41,72.18 270 top
D2  22.71,47.42 90 top
D3  22.71,55.04 90 top
D6  6.2,73.14 90 top
H1  15.73,4.87 0 top
H2  16.04,96.31 0 top
H3  165.27,32.81 0 top
H4  165.27,86.15 0 top
IC1  20.81,25.19 180 top
IC2  10.97,-73.35 0 top  (outside the outline)
IC3  -19.73,-67.35 0 top  (outside the outline)
IC5  130.66,82.66 270 top
IC7  90.97,18.53 90 top
IC10  16.04,85.52 90 top
IC11  120.82,18.21 270 top
IC12  21.12,72.82 270 top
IC13  21.12,64.88 270 top
IC15  113.52,82.66 90 top
IC16  145.58,57.26 180 top
IC17  145.27,78.85 180 top
J1  7.79,7.41 0 top
J2  7.79,65.83 0 top
J3  7.79,93.77 180 top
J8  132.25,93.77 180 top
J11  157.65,25.19 0 top
J13  172.89,25.19 0 top
J14  17.63,48.37 270 bottom
J15  114.47,7.41 0 top
J16  142.41,93.77 180 top
OSC1  55.57,29.55 0 top
PCB1  -0.34,-3 0 top
R1  7.79,22.65 0 top
R2  8.87,84.12 0 top
R3  18.71,30.4 0 top
R4  22.14,30.4 0 top
R5  12.17,-65.75 0 top  (outside the outline)
R6  60.37,29.95 180 top
R7  60.37,32.55 180 top
R8  57.67,34.05 270 top
R9  50.87,26.95 180 top
R10  48.37,26.75 90 bottom
R11  50.87,28.25 0 top
R12  50.87,31.25 180 top
R13  50.87,29.95 180 top
R14  16.36,91.23 0 top
R15  50.87,32.55 0 top
R16  121.45,82.66 90 top
R17  3.98,85.52 0 top
R18  54.07,36.15 90 top
R19  52.57,36.15 270 top
R20  -23.33,-68.75 90 top  (outside the outline)
R21  -21.23,-73.15 0 top  (outside the outline)
R22  38.47,26.15 90 top
R23  7.07,-75.15 90 top  (outside the outline)
R24  9.27,-78.95 180 top  (outside the outline)
R25  -18.23,-73.15 0 top  (outside the outline)
R26  25.57,93.77 0 top
R27  12.97,-79.05 90 top  (outside the outline)
R28  9.57,-67.35 270 top  (outside the outline)
R29  22.27,-45.95 270 top  (outside the outline)
R30  14.77,-66.85 270 top  (outside the outline)
R42  43.35,93.77 0 top
R57  31.6,87.11 0 top
R58  135.74,82.66 90 top
R59  137.33,82.66 270 top
R68  34.14,87.11 270 top
R69  37,87.11 270 top
R70  21.12,84.25 270 top
R71  18.27,81.71 180 top
R72  11.28,85.52 270 top
R73  42.08,61.71 270 top
R79  63.03,60.75 270 top
R92  95.74,17.26 270 top
R94  97.32,17.26 90 top
R134  101.77,7.41 180 top
R135  114.6,19.42 270 top
R136  109.39,30.27 0 top
R137  109.39,48.05 0 top
R141  109.39,70.91 0 top
R142  101.77,93.77 0 top
R143  125.58,18.21 90 top
R144  116.18,19.42 90 top
R147  14.77,72.82 270 top
R148  16.2,71.55 90 top
R149  26.08,65.01 90 top
R150  118.28,81.07 270 top
R152  126.85,16.62 90 top
R153  16.36,66.47 90 top
R154  14.77,66.47 270 top
R155  119.87,82.66 270 top
R156  108.75,82.66 270 top
R157  107.48,82.66 90 top
R158  117.01,93.77 0 top
R160  134.79,30.27 0 top
R162  150.35,51.55 270 top
R163  149.08,51.55 270 top
R164  147.81,51.55 270 top
R166  148.76,72.18 270 top
R167  150.03,72.18 270 top
R168  143.68,62.98 90 top
R169  139.23,57.26 90 top
R170  146.54,51.55 270 top
R171  145.27,51.55 90 top
R172  144,51.55 270 top
R173  138.92,78.85 90 top
R174  143.36,84.57 90 top
R175  146.22,72.18 270 top
R176  144.95,72.18 90 top
R177  143.68,72.18 270 top
R178  157.65,40.43 0 top
R179  147.49,72.18 270 top
R180  157.65,58.21 0 top
R181  157.65,75.99 0 top
R182  157.65,93.77 0 top
R183  172.89,40.43 0 top
R184  172.89,58.21 0 top
R185  172.89,75.99 0 top
R186  172.89,93.77 0 top
R189  62.81,29.97 90 bottom
R191  124.31,10.59 180 bottom
R192  108.75,18.53 180 bottom
R193  101.45,83.3 180 bottom
R194  132.25,18.53 180 bottom
R199  2.87,74.57 270 top
R200  125.26,83.93 90 top
R201  123.68,83.93 270 top
S1  7.79,37.89 90 top
S2  7.79,78.53 180 top
U1  14.77,76.95 270 top
U2  33.32,60.69 0 top
U3  33.02,44.18 0 top

### Tracks (layer width: path | path; a pad name or v marks a point on that pad's centre or on a via)
2.5V  (7 unrouted)
5V  (16 unrouted)
10V  (4 unrouted)
12V  (28 unrouted)
-5_TO_10V  (2 unrouted)
-5V  (12 unrouted)
-5V_OSC2  (1 unrouted)
-5V_TO_5V  (2 unrouted)
-5VIN  (3 unrouted)
-12V  (27 unrouted)
A2_IN  (1 unrouted)
A_IN  (1 unrouted)
AMPENVELOPEOUT  (3 unrouted)
CUTOFF1_MODENVINPUT  (2 unrouted)
CUTOFF2_MODENVINPUT  (2 unrouted)
CUTOFF_ENVELOPE  (1 unrouted)
CUTOFF_ENVELOPE_2  (1 unrouted)
CUTOFF_HP_IN  (1 unrouted)
CUTOFF_HP_IN_INV  (1 unrouted)
CUTOFF_IN  (1 unrouted)
CUTOFF_IN_INV  (1 unrouted)
CUTOFF_KEYTRACK  (1 unrouted)
CV_RACK  (2 unrouted)
D2_IN  (1 unrouted)
D_IN  (1 unrouted)
EXP_FM_IN  (1 unrouted)
GATE_IN  (7 unrouted)
GATE_RACK  (2 unrouted)
GATELED  (2 unrouted)
GND  (78 unrouted)
  pour Bottom: 193.91,106.22 184.48,-4.27 182.03,-4.65 -3.01,-4.65 -7.86,104.16
  pour Top: 119.14,38.91 119.14,38.81 118.6,38.27
INVERTED_CVSUM  (2 unrouted)
KEYTRACK_INPUT  (2 unrouted)
MAIN_CV  (1 unrouted)
MAIN_CV_SUMLINE  (6 unrouted)
MASTER_COARSEPITCH  (1 unrouted)
MASTER_FINEPITCH  (1 unrouted)
MODENVOUT  (6 unrouted)
N$1  (2 unrouted)
N$2  (2 unrouted)
N$3  (2 unrouted)
N$4  (1 unrouted)
N$5  (1 unrouted)
N$6  (1 unrouted)
N$7  (2 unrouted)
N$8  (2 unrouted)
N$9  (1 unrouted)
N$10  (1 unrouted)
N$11  (1 unrouted)
N$12  (1 unrouted)
N$13  (2 unrouted)
N$14  (1 unrouted)
N$15  (2 unrouted)
N$16  (1 unrouted)
N$17  (1 unrouted)
N$18  (2 unrouted)
N$19  (1 unrouted)
N$20  (1 unrouted)
N$21  (1 unrouted)
N$22  (1 unrouted)
N$23  (3 unrouted)
N$24  (2 unrouted)
N$25  (1 unrouted)
N$26  (3 unrouted)
N$27  (5 unrouted)
N$28  (1 unrouted)
N$29  (1 unrouted)
N$30  (2 unrouted)
N$31  (1 unrouted)
N$39  (1 unrouted)
N$41  (2 unrouted)
N$56  (2 unrouted)
N$58  (2 unrouted)
N$59  (2 unrouted)
N$60  (2 unrouted)
N$61  (1 unrouted)
N$62  (1 unrouted)
N$63  (1 unrouted)
N$64  (1 unrouted)
N$65  (1 unrouted)
N$66  (2 unrouted)
N$67  (2 unrouted)
N$68  (1 unrouted)
N$69  (2 unrouted)
N$72  (2 unrouted)
N$73  (1 unrouted)
N$75  (2 unrouted)
N$76  (1 unrouted)
N$78  (1 unrouted)
N$81  (1 unrouted)
N$82  (2 unrouted)
N$86  (1 unrouted)
N$126  (2 unrouted)
N$127  (1 unrouted)
N$143  (1 unrouted)
N$145  (1 unrouted)
N$146  (1 unrouted)
N$148  (2 unrouted)
OSC1_AFTERFMSEL  (2 unrouted)
OSC1_FM  (1 unrouted)
OSC1_LIN_FREQ  (1 unrouted)
OSC1_MIX  (1 unrouted)
OSC1_SQUARE  (2 unrouted)
OSC1_TIME_REVERSE  (3 unrouted)
OSC1_TRI  (2 unrouted)
PITCH_ENV  (1 unrouted)
PITCH_ENV_2  (1 unrouted)
PITCHENVMOD2  (2 unrouted)
PITCHENVMODINP1  (2 unrouted)
POSTINVERTED_CVSUM  (2 unrouted)
PRESUMMED_PITCH  (4 unrouted)
R2_IN  (1 unrouted)
R_IN  (1 unrouted)
S2_IN  (1 unrouted)
S_IN  (1 unrouted)
SILENT5V  (1 unrouted)